# Altium schematic sheet 智能家居-窗帘-控制板.SchDoc
size A4
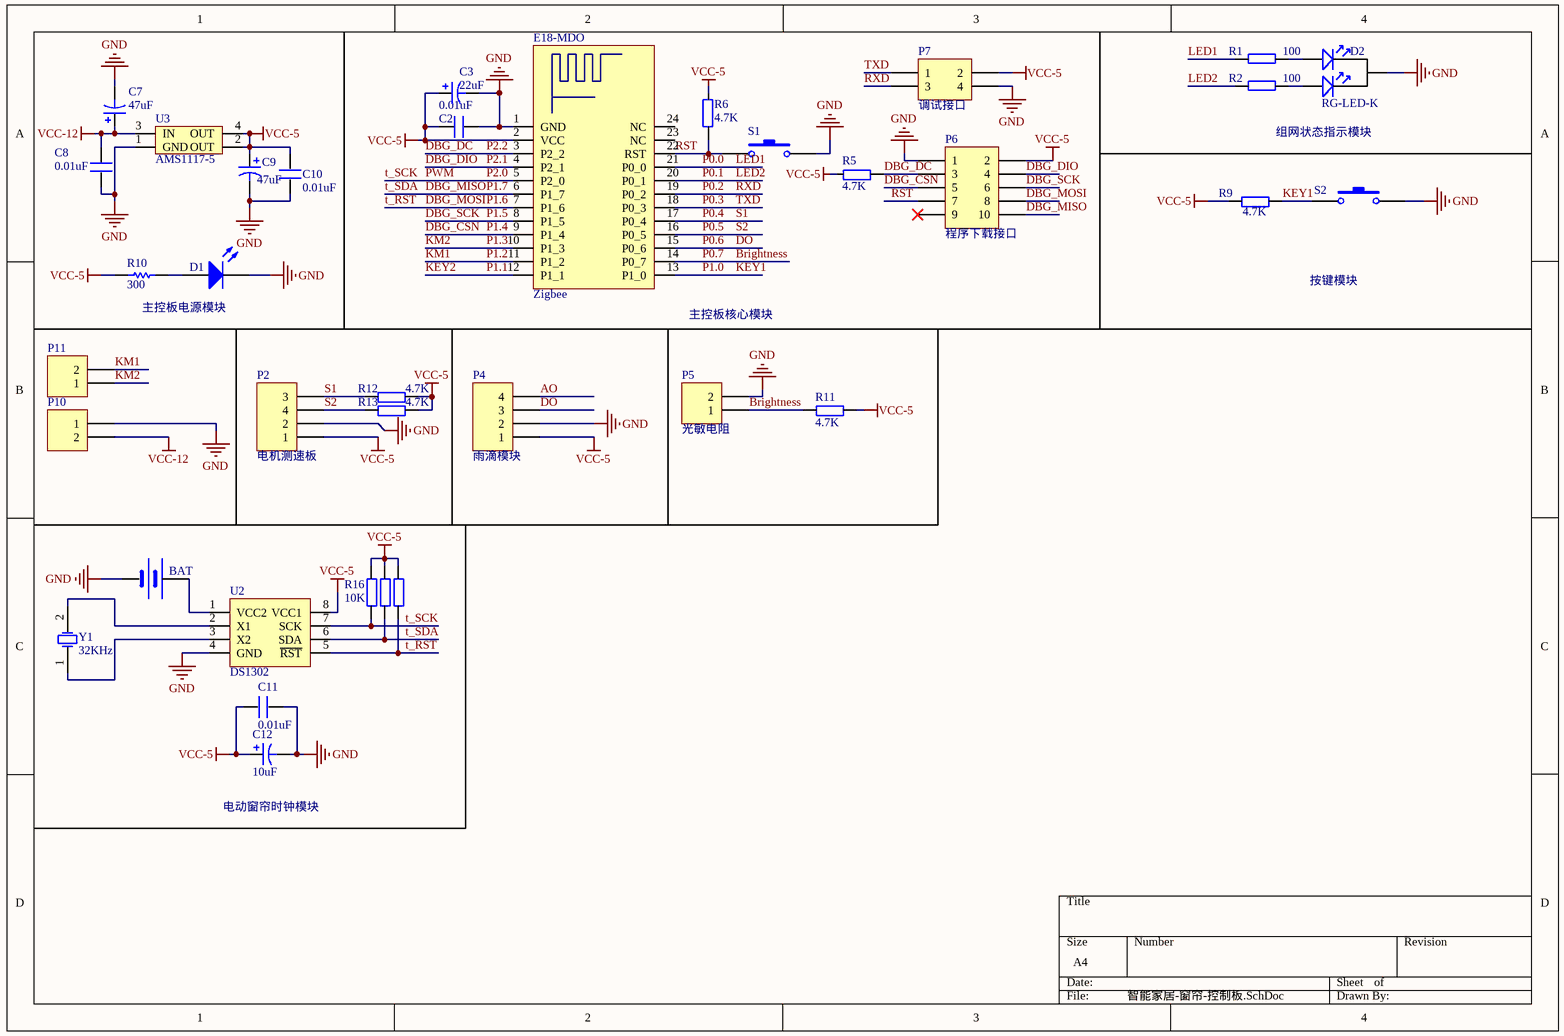
[diagram p0: 智能家居-窗帘-控制板.SchDoc]

## Parts
BAT  BATT  [BATM]  (value not drawn)
C2  0.01uF  [0.1UF]
C3  value 22uF  [CD5]  (hidden comment: Cap Pol1)
C7  value 47uF  [CD5]  (hidden comment: Cap Pol1)
C8  0.01uF  [0.1UF]
C9  value 47uF  [CD5]  (hidden comment: Cap Pol1)
C10  0.01uF  [0.1UF]
C11  0.01uF  [0.1UF]
C12  value 10uF  [CD5]  (hidden comment: Cap Pol1)
D1  LED0  [LED-3]  (value not drawn)
D2  RG-LED-K  [RG-LED]
E18-MDO  Zigbee  [E18-MD0-1]
P2  电机测速板  [HDR1X4]
P4  雨滴模块  [DG1284]
P5  光敏电阻  [HDR1X2]
P6  程序下载接口  [HDR2X5]
P7  调试接口  [HDR2X2]
P10  Header 2  [TJC3-2A]  (value not drawn)
P11  Header 2  [TJC3-2A]  (value not drawn)
R1  100  [AXIAL-0.3]
R2  100  [AXIAL-0.3]
R5  4.7K  [AXIAL-0.3]
R6  4.7K  [AXIAL-0.3]
R9  4.7K  [AXIAL-0.3]
R10  value 300  [AXIAL-0.3]  (hidden comment: Res1)
R11  4.7K  [AXIAL-0.3]
R12  4.7K  [AXIAL-0.4]
R13  4.7K  [AXIAL-0.4]
R16  10K  [AXIAL-0.3]
R17  10K  [AXIAL-0.3]  (value not drawn)
R18  10K  [AXIAL-0.3]  (value not drawn)
S1  SW-PB  [KEY_M]  (value not drawn)
S2  SW-PB  [KEY_M]  (value not drawn)
U2  DS1302  [DIP-8N]
U3  AMS1117-5  [AMS1117]
Y1  32KHz  [3216]

## Nets
GND: BAT.2(GND) C2.2 C3.2 C7.2 C8.1 C9.2 C10.1 C11.2 C12.2 D1.2(K) D2.2(GND) E18-MDO.1(GND) P2.2 P4.2 P5.2 P6.1 P7.4 P10.1 S1.2 S2.2 U2.4(GND) U3.1(GND)
VCC-5: C2.1 C3.1 C9.1 C10.2 C11.1 C12.1 E18-MDO.2(VCC) P2.1 P4.1 P6.2 P7.2 R5.1 R6.1 R9.1 R10.1 R11.2 R12.2 R13.2 R16.2 R17.2 R18.2 U2.8(VCC1) U3.2(OUT) U3.4(OUT)
VCC-12: C7.1 C8.2 P10.2 U3.3(IN)
AO: P4.4
Brightness: E18-MDO.14(P0_7) P5.1 R11.1  [also labelled P0.7]
DBG_CSN: E18-MDO.9(P1_4) P6.5  [also labelled P1.4]
DBG_DC: E18-MDO.3(P2_2) P6.3 R5.2  [also labelled P2.2]
DBG_DIO: E18-MDO.4(P2_1) P6.4  [also labelled P2.1]
DBG_MISO: E18-MDO.6(P1_7) P6.10 R17.1 U2.6(SDA)  [also labelled P1.7, t_SDA]
DBG_MOSI: E18-MDO.7(P1_6) P6.8 R18.1 U2.5(~{RST})  [also labelled P1.6, t_RST]
DBG_SCK: E18-MDO.8(P1_5) P6.6  [also labelled P1.5]
DO: E18-MDO.15(P0_6) P4.3  [also labelled P0.6]
KEY1: E18-MDO.13(P1_0) R9.2 S2.1  [also labelled P1.0]
KEY2: E18-MDO.12(P1_1)  [also labelled P1.1]
KM1: E18-MDO.11(P1_2) P11.2  [also labelled P1.2]
KM2: E18-MDO.10(P1_3) P11.1  [also labelled P1.3]
LED1: E18-MDO.21(P0_0) R1.2  [also labelled P0.0]
LED2: E18-MDO.20(P0_1) R2.2  [also labelled P0.1]
P0.2: E18-MDO.19(P0_2) P7.3  [also labelled RXD]
P0.3: E18-MDO.18(P0_3) P7.1  [also labelled TXD]
P0.4: E18-MDO.17(P0_4) P2.3 R12.1  [also labelled S1]
P0.5: E18-MDO.16(P0_5) P2.4 R13.1  [also labelled S2]
P2.0: E18-MDO.5(P2_0) R16.1 U2.7(SCK)  [also labelled PWM, t_SCK]
RST: E18-MDO.22(RST) P6.7 R6.2 S1.1
NetBAT_1: BAT.1(VCC) U2.1(VCC2)
NetD1_1: D1.1(A) R10.2
NetD2_1: D2.1(R) R1.1
NetD2_3: D2.3(G) R2.1
NetU2_2: U2.2(X1) Y1.2(OSC2)
NetU2_3: U2.3(X2) Y1.1(OSC1)

Not connected (* = marked no-connect by the designer): E18-MDO 23(NC) 24(NC); P6 9*

## Notes on the sheet
- 组网状态指示模块
- 主控板电源模块
- 按键模块
- 主控板核心模块
- (near C12) 电动窗帘时钟模块

## Library data of the parts
BAT = BAT
C2 C8 C10 C11 = C
C3 C7 C9 C12 = Cap Pol1: Polarized Capacitor (Radial); Published: 8-Jun-2000; LatestRevisionDate: 17-Jul-2002; LatestRevisionNote: Re-released for DXP Platform.; PackageReference: RB7.6-15; Publisher: Altium Limited; PackageDescription: Polarized Capacitor (Radial); 2 Leads
D1 = LED0: Typical INFRARED GaAs LED; Published: 8-Jun-2000; LatestRevisionDate: 08-Jul-2005; LatestRevisionNote: Mech Layer 1 removed.; PackageReference: LED-0; Publisher: Altium Limited; PackageDescription: LED; 2 Leads
E18-MDO = E18-MDO: Zigbee模块
P2 P4 = Header 4: Header, 4-Pin; LatestRevisionDate: 17-Jul-2002; LatestRevisionNote: Re-released for DXP Platform.; Publisher: Altium Limited
P5 P10 P11 = Header 2: Header, 2-Pin; LatestRevisionDate: 17-Jul-2002; LatestRevisionNote: Re-released for DXP Platform.; Publisher: Altium Limited
P6 = Header 5X2: Header, 5-Pin, Dual row; LatestRevisionDate: 17-Jul-2002; LatestRevisionNote: Re-released for DXP Platform.; Publisher: Altium Limited
P7 = Header 2X2H: Header, 2-Pin, Dual row, Right Angle; LatestRevisionDate: 17-Jul-2002; LatestRevisionNote: Re-released for DXP Platform.; Publisher: Altium Limited
R1 R2 R5 R6 R9 R11-R13 R16-R18 = R
R10 = Res1: Resistor; Published: 8-Jun-2000; LatestRevisionDate: 17-Jul-2002; LatestRevisionNote: Re-released for DXP Platform.; PackageReference: AXIAL-0.3; Publisher: Altium Limited; PackageDescription: Axial Device, Thru-Hole; 2 Leads; 0.3 in Pin Spacing
S1 S2 = SW-PB: Switch; Published: 24-Mar-1999; LatestRevisionDate: 17-Jul-2002; LatestRevisionNote: Re-released for DXP Platform.; PackageReference: SPST-2; Publisher: Altium Limited; PackageDescription: Switch; 2 Leads
U3 = AMS1117
Y1 = XTAL: Crystal Oscillator; Published: 8-Jun-2000; LatestRevisionDate: 17-Jul-2002; LatestRevisionNote: Re-released for DXP Platform.; PackageReference: R38; Publisher: Altium Limited; PackageDescription: Crystal, Thru-Hole; 2 Leads; Body 3.1 x 8.2 mm (Dia.xH)